# Altium schematic sheet 16 INTERFACE.SchDoc
size A2; ApprovedBy: DNP; CheckedBy: DNP; Author: DNP; CompanyName: Google LLC; DrawnBy: DNP; Organization: Google LLC; Address1: 1600 Amphitheatre Parkway; Address2: Mountain View, CA 94043; Address3: DNP; Address4: DNP; DocumentNumber: 16; SheetNumber: 16; SheetTotal: 17; VersionControl_RevNumber: DNP; IsUserConfigurable: DNP; Time: DNP; ImagePath: DNP; Rule: DNP; ProjectName: Enterprise; Application_BuildNumber: DNP
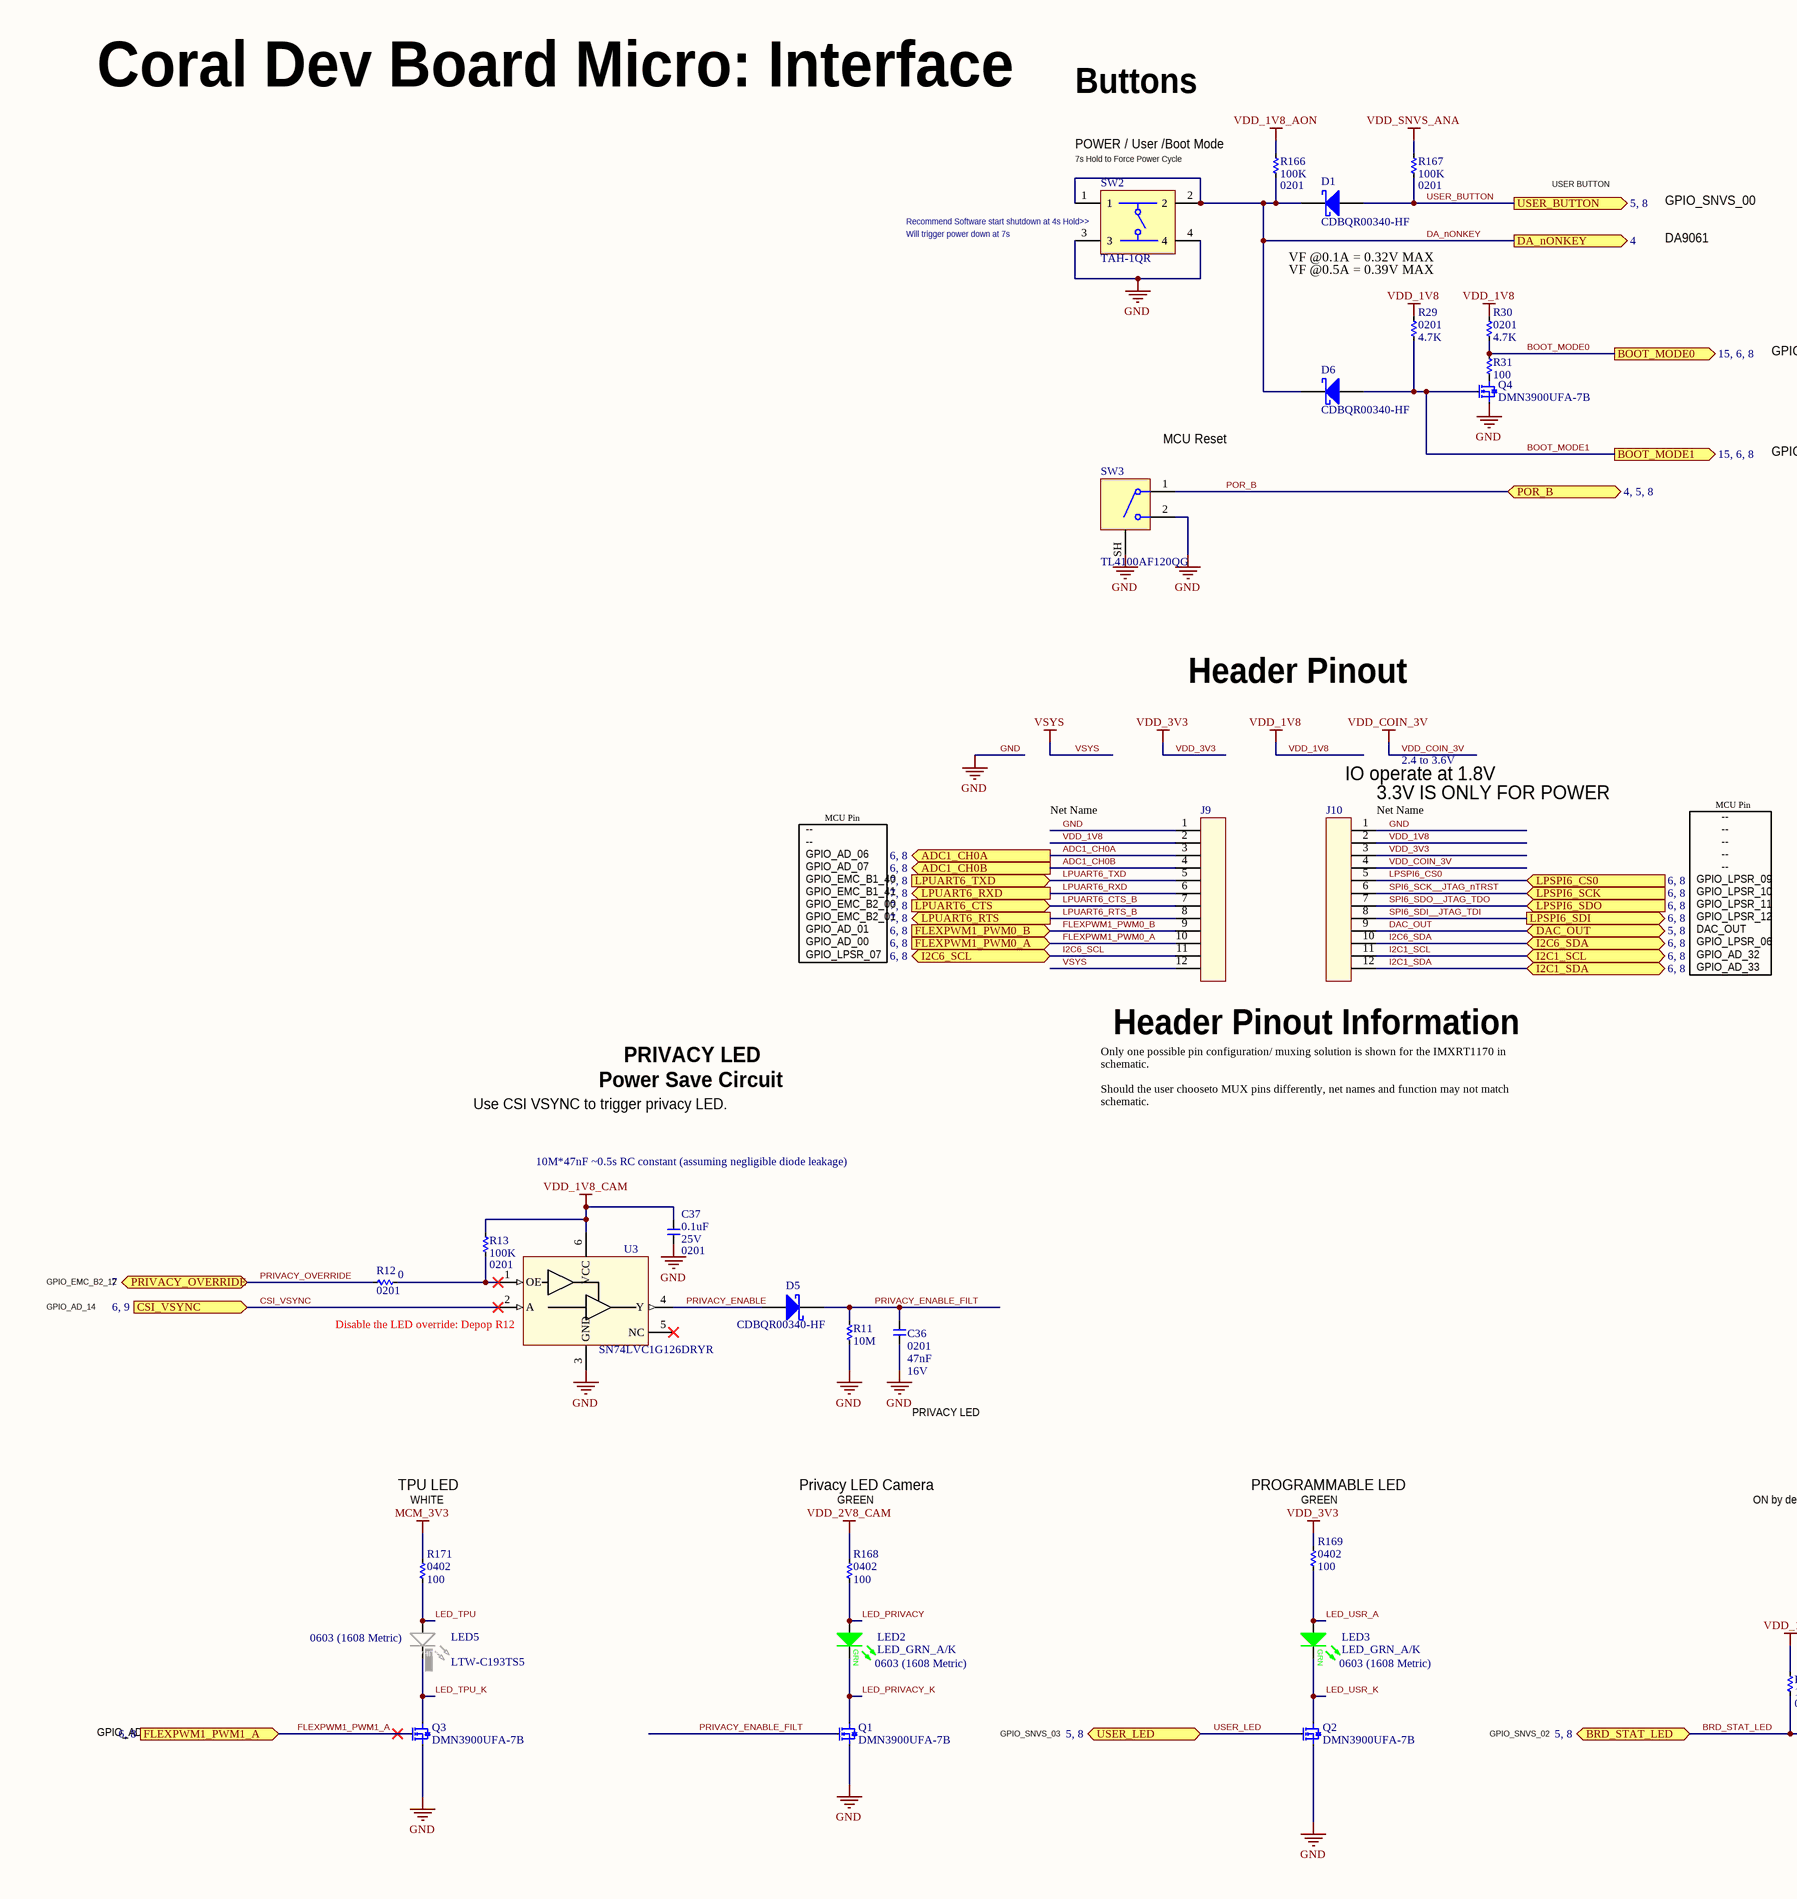
[diagram p0: 16 INTERFACE.SchDoc, left]
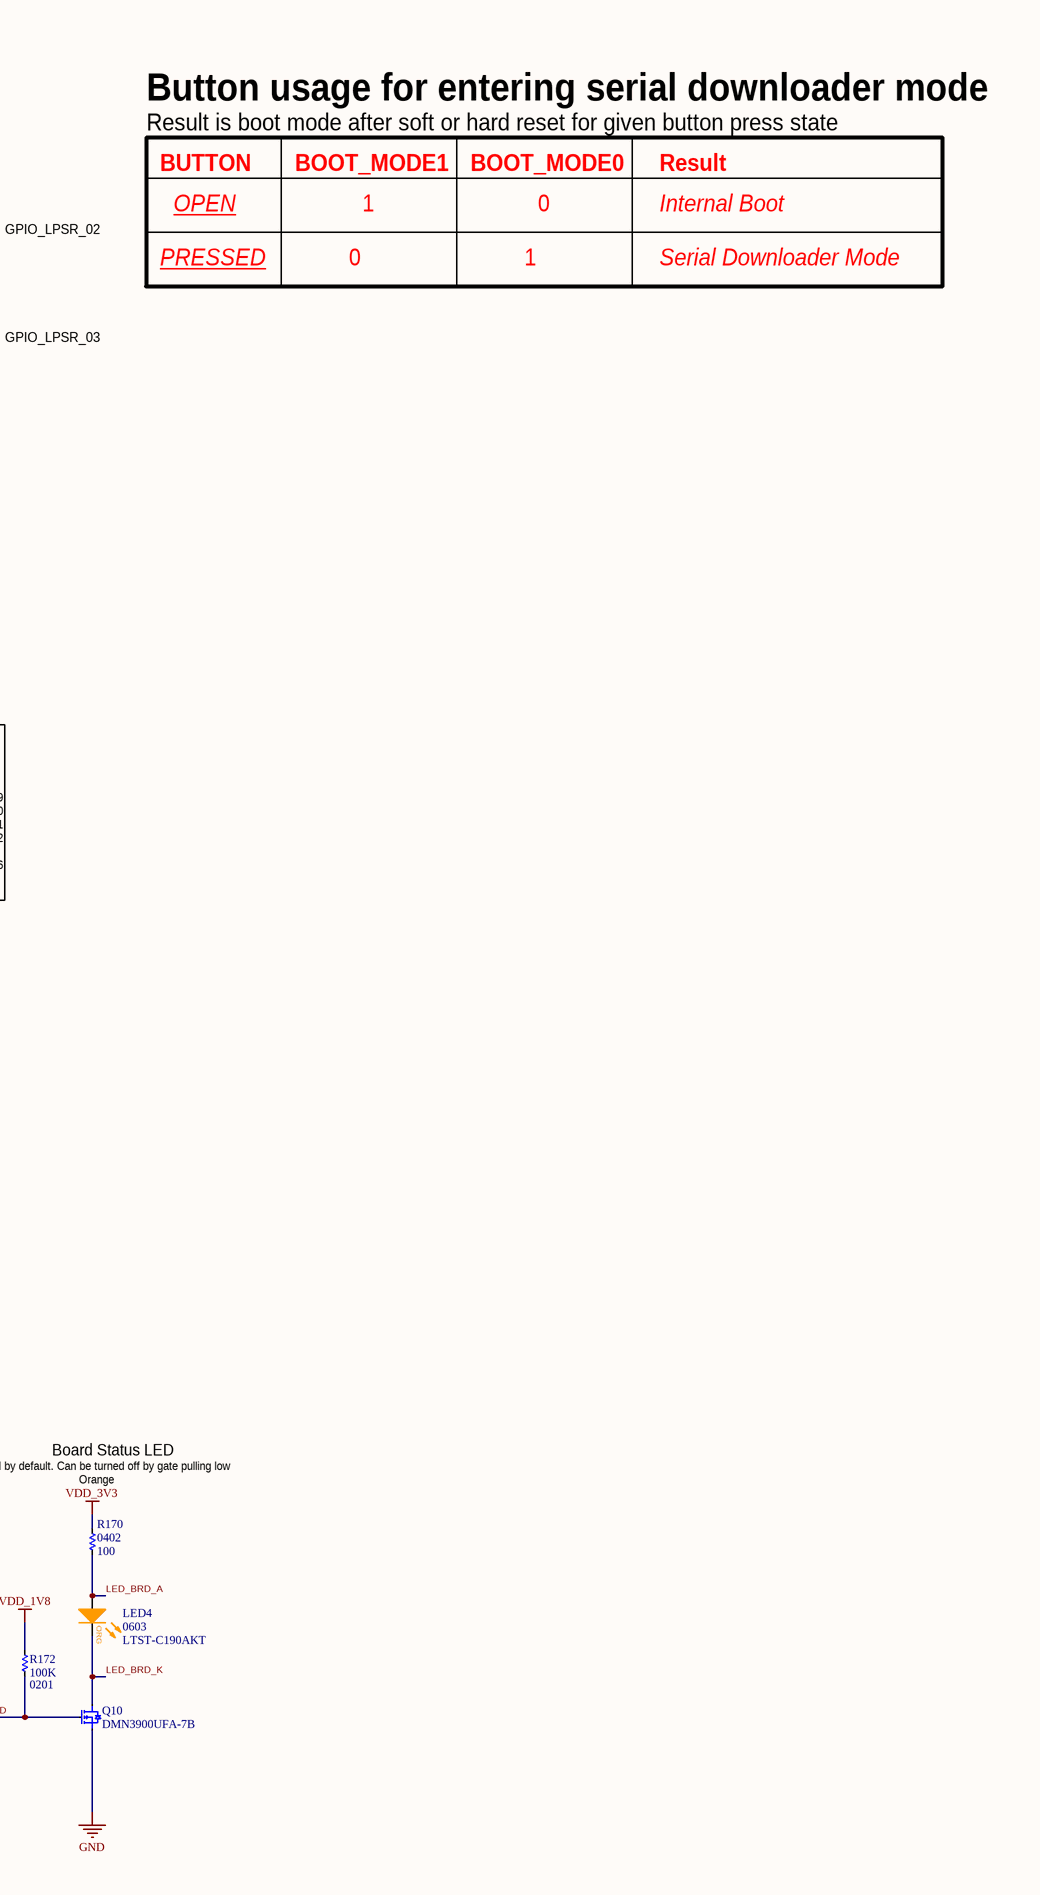
[diagram p1: 16 INTERFACE.SchDoc, right]

## Parts
C36  value 47nF  Package: 0201  Voltage: 16V  [C0201]  (hidden comment: __Template_Cap)
C37  value 0.1uF  Package: 0201  Voltage: 25V  [C0201Y]  (hidden comment: __Template_Cap)
D1  value CDBQR00340-HF  [D0402_H0.55MM]  (hidden comment: __Template_DIODE_SCHOTTKY)
D5  value CDBQR00340-HF  [D0402_H0.55MM]  (hidden comment: __Template_DIODE_SCHOTTKY)
D6  value CDBQR00340-HF  [D0402_H0.55MM]  (hidden comment: __Template_DIODE_SCHOTTKY)
J9  (no value)  [HEADER_1X12_POS_UNSHROUDED]
J10  (no value)  [HEADER_1X12_POS_UNSHROUDED]
LED2  LED_GRN_A/K  Package: 0603 (1608 Metric)  [LED_0603_0.67mm]
LED3  LED_GRN_A/K  Package: 0603 (1608 Metric)  [LED_0603_0.67mm]
LED4  value LTST-C190AKT  Package: 0603  [LED_0603P_ORANGE]  (hidden comment: __Template_LED_ORG)
LED5  value LTW-C193TS5  Package: 0603 (1608 Metric)  [LED_0603P_WHITE]  (hidden comment: __Template_LED_WHT)
Q1  MFG P/N: DMN3900UFA-7B  [3XDFN]  (hidden comment: NFET_DMN3900UFA)
Q2  MFG P/N: DMN3900UFA-7B  [3XDFN]  (hidden comment: NFET_DMN3900UFA)
Q3  MFG P/N: DMN3900UFA-7B  [3XDFN]  (hidden comment: NFET_DMN3900UFA)
Q4  MFG P/N: DMN3900UFA-7B  [3XDFN]  (hidden comment: NFET_DMN3900UFA)
Q10  MFG P/N: DMN3900UFA-7B  [3XDFN]  (hidden comment: NFET_DMN3900UFA)
R11  value 10M  [R0402]
R12  value 0  Package: 0201  [R0201]
R13  value 100K  Package: 0201  [R0201]
R29  value 4.7K  Package: 0201  [R0201]
R30  value 4.7K  Package: 0201  [R0201]
R31  value 100  [R0201]
R166  value 100K  Package: 0201  [R0201]
R167  value 100K  Package: 0201  [R0201]
R168  value 100  Package: 0402  [R0402]
R169  value 100  Package: 0402  [R0402]
R170  value 100  Package: 0402  [R0402]
R171  value 100  Package: 0402  [R0402]
R172  value 100K  Package: 0201  [R0201]
SW2  MFG P/N: TAH-1QR  [SWITCH_TAH1QR]  (hidden comment: SWITCH_TAH1QR)
SW3  MFG P/N: TL4100AF120QG  [SWITCH_TL4100AF120QG]  (hidden comment: SWITCH_E-SWITCH_TL4100AF120QG)
U3  MFG P/N: SN74LVC1G126DRYR  [SON50P145X100X60-6]  (hidden comment: BUF_SN74LVC1G126DRYR)

## Ports
ADC1_CH0A (out, see 6, 8), ADC1_CH0B (out, see 6, 8), BOOT_MODE0 (out, see 15, 6, 8), BOOT_MODE1 (out, see 15, 6, 8), BRD_STAT_LED (bidir, see 5, 8), CSI_VSYNC (in, see 6, 9), DA_nONKEY (out, see 4), DAC_OUT (bidir, see 5, 8), FLEXPWM1_PWM0_A (in, see 6, 8), FLEXPWM1_PWM0_B (in, see 6, 8), FLEXPWM1_PWM1_A (in, see 6, 8), I2C1_SCL (bidir, see 6, 8), I2C1_SDA (bidir, see 6, 8), I2C6_SCL (bidir, see 6, 8), I2C6_SDA (bidir, see 6, 8), LPSPI6_CS0 (in, see 6, 8), LPSPI6_SCK (in, see 6, 8), LPSPI6_SDI (out, see 6, 8), LPSPI6_SDO (in, see 6, 8), LPUART6_CTS (in, see 7, 8), LPUART6_RTS (out, see 7, 8), LPUART6_RXD (out, see 7, 8), LPUART6_TXD (in, see 7, 8), POR_B (bidir, see 4, 5, 8), PRIVACY_OVERRIDE (bidir, see 7), USER_BUTTON (out, see 5, 8), USER_LED (bidir, see 5, 8)

## Nets
GND: C36.2 C37.2 J9.1 J10.1 Q1.2(S) Q2.2(S) Q3.2(S) Q4.2(S) Q10.2(S) R11.1 SW2.3 SW2.4 SW3.2 SW3.SH U3.3(GND)
MCM_3V3: R171.2
VDD_1V8: J9.2 J10.2 R29.2 R30.2 R172.2
VDD_1V8_AON: R166.2
VDD_1V8_CAM: C37.1 R13.2 U3.6(VCC)
VDD_2V8_CAM: R168.2
VDD_3V3: J10.3 R169.2 R170.2
VDD_COIN_3V: J10.4
VDD_SNVS_ANA: R167.2
VSYS: J9.12
ADC1_CH0A: J9.3 ; port ADC1_CH0A
ADC1_CH0B: J9.4 ; port ADC1_CH0B
BOOT_MODE0: R30.1 R31.2 ; port BOOT_MODE0
BOOT_MODE1: D6.A Q4.1(G) R29.1 ; port BOOT_MODE1
BRD_STAT_LED: Q10.1(G) R172.1 ; port BRD_STAT_LED
CSI_VSYNC: U3.2(A) ; port CSI_VSYNC
DA_nONKEY: D1.K D6.K R166.1 SW2.1 SW2.2 ; port DA_nONKEY
DAC_OUT: J10.9 ; port DAC_OUT
FLEXPWM1_PWM0_A: J9.10 ; port FLEXPWM1_PWM0_A
FLEXPWM1_PWM0_B: J9.9 ; port FLEXPWM1_PWM0_B
FLEXPWM1_PWM1_A: Q3.1(G) ; port FLEXPWM1_PWM1_A
I2C1_SCL: J10.11 ; port I2C1_SCL
I2C1_SDA: J10.12 ; port I2C1_SDA
I2C6_SCL: J9.11 ; port I2C6_SCL
I2C6_SDA: J10.10 ; port I2C6_SDA
LED_BRD_A: LED4.2(A) R170.1
LED_BRD_K: LED4.1(K) Q10.3(D)
LED_PRIVACY: LED2.A R168.1
LED_PRIVACY_K: LED2.K Q1.3(D)
LED_TPU: LED5.2(A) R171.1
LED_TPU_K: LED5.1(K) Q3.3(D)
LED_USR_A: LED3.A R169.1
LED_USR_K: LED3.K Q2.3(D)
LPSPI6_CS0: J10.5 ; port LPSPI6_CS0
LPUART6_CTS_B: J9.7 ; port LPUART6_CTS
LPUART6_RTS_B: J9.8 ; port LPUART6_RTS
LPUART6_RXD: J9.6 ; port LPUART6_RXD
LPUART6_TXD: J9.5 ; port LPUART6_TXD
POR_B: SW3.1 ; port POR_B
PRIVACY_ENABLE: D5.A U3.4(Y)
PRIVACY_ENABLE_FILT: C36.1 D5.K Q1.1(G) R11.2
PRIVACY_OVERRIDE: R12.2 ; port PRIVACY_OVERRIDE
SPI6_SCK__JTAG_nTRST: J10.6 ; port LPSPI6_SCK
SPI6_SDI__JTAG_TDI: J10.8 ; port LPSPI6_SDI
SPI6_SDO__JTAG_TDO: J10.7 ; port LPSPI6_SDO
USER_BUTTON: D1.A R167.1 ; port USER_BUTTON
USER_LED: Q2.1(G) ; port USER_LED
NetQ4_3: Q4.3(D) R31.1
NetR12_1: R12.1 R13.1 U3.1(OE)

Not connected (* = marked no-connect by the designer): U3 5(NC)*

## Notes on the sheet
- Coral Dev Board Micro: Interface
- Buttons
- POWER / User /Boot Mode
- (near SW2) 7s Hold to Force Power Cycle
- (near SW2) Recommend Software start shutdown at 4s Hold>>
- Will trigger power down at 7s
- USER BUTTON
- GPIO_SNVS_00
- Button usage for entering serial downloader mode
- VF @0.1A = 0.32V MAX
- VF @0.5A = 0.39V MAX
- DA9061
- Result is boot mode after soft or hard reset for given button press state
- BUTTON
- BOOT_MODE1
- BOOT_MODE0
- Result
- GPIO_LPSR_02
- OPEN
- 1
- 0
- Internal Boot
- PRESSED
- Serial Downloader Mode
- (near SW3) MCU Reset
- GPIO_LPSR_03
- Header Pinout
- IO operate at 1.8V
- 3.3V IS ONLY FOR POWER
- 2.4 to 3.6V
- MCU Pin
- GPIO_AD_06
- --
- Net Name
- (near J10) Net Name
- GPIO_EMC_B1_40
- GPIO_EMC_B1_41
- GPIO_EMC_B2_00
- GPIO_EMC_B2_01
- GPIO_AD_01
- GPIO_AD_07
- GPIO_LPSR_09
- GPIO_LPSR_10
- GPIO_LPSR_11
- GPIO_LPSR_12
- DAC_OUT
- GPIO_AD_00
- GPIO_LPSR_07
- GPIO_AD_32
- GPIO_AD_33
- GPIO_LPSR_06
- Header Pinout Information
- Power Save Circuit
- PRIVACY LED
- Only one possible pin configuration/ muxing solution is shown for the IMXRT1170 in schematic.
  Should the user chooseto MUX pins differently, net names and function may not match schematic.
- Use CSI VSYNC to trigger privacy LED.
  Discharge RC time constant approximately 500ms. Likely to be shorter due to leakage paths.
- 10M*47nF ~0.5s RC constant (assuming negligible diode leakage)
- GPIO_EMC_B2_12
- GPIO_AD_14
- (near U3) Disable the LED override: Depop R12
- TPU LED
- Privacy LED Camera
- PROGRAMMABLE LED
- Board Status LED
- WHITE
- GREEN
- (near R169) GREEN
- ON by default. Can be turned off by gate pulling low
- (near R170) Orange
- GPIO_AD_02
- GPIO_SNVS_03
- GPIO_SNVS_02
- Project:
- Engineer:
- Date:
- File:
- Revision:
- Sheet
- of
- (in symbol 61) ORG
- (in symbol 197) GRN

## Library data of the parts
C36 = 799: CAP, CER, X6S, 0.047uF, 16V, 10%, 0201, 0.33mm T; ID: 799; MFG: TDK; MFG P/N: C0603X6S1C473K030BC; XPN: 150-00153-00; Status: NRND; Dielectric: X6S; Tolerance: 10%; Height: 0.33mm T; ComponentLink1Description: Datasheet; COMMON: 150-00153-00
C37 = 386: CAP, CER, X5R, 0.1uF, 25V, 20%, 0201, 0.33mm T; ID: 386; MFG: MURATA; MFG P/N: GRM033R61E104ME14D; XPN: 150-01204-00; Status: Released; Dielectric: X5R; Tolerance: 20%; Height: 0.33mm T; ComponentLink1Description: Datasheet; COMMON: 150-01204-00; LOON: 150-01204-00; Gecko: 150-01204-00
D1 D5 D6 = 353: DIODE, SCHOTTKY, 40V VRRM, 30mA IO, 500mA SURGE, 0402; ID: 353; MFG: Comchip Technology; Voltage – Forward (VF) (MAX) @ IF: 370 mV @ 1 mA; Current - Reverse Leakage @ VR: 1 µA @ 40 V; Status: Released; MFG P/N: CDBQR00340-HF; Package: 0402; Category: DIODE; RoHS Compliant: Yes; Diode Type: Schottky; Mounting Type: SMD; Voltage - DC Reverse (VR) (MAX): 40V; Current - Average Rectified (IO): 30mA; Operating Temperature – Junction: 125°C (Max); Supplier 1: Digi-Key; HelpURL: https://www.digikey.com/en/products/detail/comchip-technology/CDBQR00340-HF/3308478?s=N4IgTCBcDaIMIBEBCBFASgBgwZgCwYFoAJAMRAF0BfIA; ComponentLink1Description: Datasheet; ComponentLink1URL: https://www.comchiptech.com/admin/files/product/QW-G1106%20CDBQR00340-HF%20RevB.pdf; Height: 0.55mm; Supplier Part Number 1: 641-1978-2-ND
J9 J10 = 366: CONN, HDR, TH, STR, 1X12, 2.54mmP; ID: 366; MFG: SULLINS; MFG P/N: PBC12SAAN; COMMON: 210-00118-00; Status: Released; RoHS Compliant: Yes; LOON: 210-00118-00; XPN: 210-00118-00; Gecko: 210-00118-00
LED2 LED3 = 197: LED, GREEN, 570nm, 25mA, DIFFUSED, 0603; ID: 197; MFG: OSRAM Opto Semiconductors Inc.; MFG P/N: LG L29K-G2J1-24-Z; Value: LG L29K-G2J1-24-Z; Voltage – Forward (VF) (MAX) @ IF: 1.7V; COMMON: 370-00021-00; PROXY: 370-00433-00; Status: In Development; Category: LED; RoHS Compliant: Yes; Diode Type: LED; Mounting Type: SMD; Supplier 1: Digi-Key; HelpURL: https://www.digikey.in/product-detail/en/osram-opto-semiconductors-inc/LG-L29K-G2J1-24-Z/475-2709-1-ND/1938876; ComponentLink1Description: Datasheet; ComponentLink1URL: https://dammedia.osram.info/media/resource/hires/osram-dam-2493945/LG%20L29K.pdf; LOON: 370-00021-00; Color / Wavelength: GREEN; Supplier Part Number 1: 475-2709-1-ND
LED4 = 61: LED, ORANGE, 610NM, WATER CLEAR, GAP, 0603; ID: 61; MFG: Lite-On Technology Corp; Current - Average Rectified (IO): 10mA; Voltage – Forward (VF) (MAX) @ IF: 2.1V; PROXY: 246-00083-00; XPN: XS-10006042; Gecko: 370-00585-00; Orbital: 370-00646-00; Status: Released; MFG P/N: LTST-C190AKT; Category: Diode; Diode Type: LED; Mounting Type: SM; Operating Temperature – Junction: -40°C ~ 85°C; Supplier 1: Digi-Key; HelpURL: http://media.digikey.com/pdf/Data%20Sheets/Lite-On%20PDFs/LTST-C190AKT.pdf; ComponentLink1Description: Datasheet; ComponentLink1URL: http://media.digikey.com/pdf/Data%20Sheets/Lite-On%20PDFs/LTST-C190AKT.pdf; Color / Wavelength: ORANGE; Supplier Part Number 1: 160-1180-1-ND
LED5 = 69: LED, WHITE, 0603, SMD; ID: 69; MFG: Lite-On Technology Corp; Current - Average Rectified (IO): 5mA; Voltage – Forward (VF) (MAX) @ IF: 2.93V; COMMON: 246-00092-00; KOI: 370-00551-00; XPN: XS-10006051; Status: Released; MFG P/N: LTW-C193TS5; Category: Diode; Diode Type: LED; Mounting Type: SM; Operating Temperature – Junction: -20°C ~ +80°C; Supplier 1: Digi-Key; HelpURL: http://optoelectronics.liteon.com/upload/download/DS22-2004-203/S_110_LTW-C193TS5.pdf; ComponentLink1Description: Datasheet; ComponentLink1URL: http://optoelectronics.liteon.com/upload/download/DS22-2004-203/S_110_LTW-C193TS5.pdf; LOON: 246-00092-00; Gecko: 246-00092-00; Color / Wavelength: WHITE; Supplier Part Number 1: 160-1721-1-ND
Q1-Q4 Q10 = 24: MOSFET, N-CH, 30V, 0.55A, DMN3900; ID: 24; MFG: Diodes Incorporated; FET Type: MOSFET N-Channel, Metal Oxide; FET Feature: Logic Level Gate; Current - Continuios Drain (ID) @ 25° C: 550mA; RDS On (Max) @ ID, VGS: 760 mOhm @ 200mA, 4.5V; VGS(TH) (Max) @ ID: 950mV @ 250µA; Gate Charge (QG) @ VGS: 0.7nC @ 4.5V; Input Capacitance (CISS) @ VDS: 42.2pF @ 25V; Power - Max: 390mW; COMMON: 480-00750-00; XPN: XS-10020699; EES: 480-01751-00; Status: Released; Package: 3-XFDFN; Category: Discrete Semiconductor Products; RoHS Compliant: Yes; HelpURL: http://www.diodes.com/datasheets/DMN3900UFA.pdf; ComponentLink1Description: Datasheet; ComponentLink1URL: http://www.diodes.com/datasheets/DMN3900UFA.pdf; Voltage - Drain To Source (VDSS): 30V; Mounting Type: SM; Supplier 1: Digi-Key; Supplier Part Number 1: DMN3900UFA-7BCT-ND
R11 = 6216: Resistor, 10.0M Ohms, 0402, 0.063W, ±1%; ID: 6216; MFG: YAGEO; MFG P/N: RC0402FR-0710ML; Power: 1/16W; COMMON: 470-09411-00; XPN: XS-10019877; Status: Released; Package: 0402; Tolerance: 1%; Height: 0.40mm; Supplier 1: Digi-Key; Supplier Part Number 1: 311-10.0MLRCT-ND
R12 = 8315: RES, 0.0, 1/20W, 0201; ID: 8315; MFG: PANASONIC; MFG P/N: ERJ1GN0R00C; Tolerance: JUMPER; COMMON: 470-00013-00; PROXY: Use ID #6940; Status: Released; Power: 1/20W; LOON: 470-00013-00; Gecko: 470-00013-00; XPN: 470-00013-00
R13 R166 R167 R172 = 7818: RES, 100K, 1%, 1/20W, 0201; ID: 7818; MFG: PANASONIC; MFG P/N: ERJ1GEF1003C; COMMON: 470-00506-00; Status: NRND; Power: 1/20W; Tolerance: 1%; LOON: 470-00506-00; Gecko: 470-00506-00; XPN: 470-00506-00
R29 R30 = 6602: RES, 4.7K, 5%, 1/20W, 0201; ID: 6602; MFG: YAGEO; MFG P/N: RC0201JR-074K7L; COMMON: 470-00012-00; Status: Released; Power: 1/20W; Tolerance: 5%; LOON: 470-00012-00; Gecko: 470-00012-00; XPN: 470-00012-00
R31 = 6785: RES, 100, 5%, 1/20W, 0201; ID: 6785; MFG: YAGEO; MFG P/N: RC0201JR-07100RL; COMMON: 470-00473-00; Status: Released; Package: 0201; Power: 1/20W; Tolerance: 5%; XPN: 470-00473-00
R168-R171 = 6318: RES, 100, 5%, 1/16W, 0402, AUTO GRADE; ID: 6318; MFG: VISHAY; MFG P/N: CRCW0402100RJNED; COMMON: 470-02903-00; Status: Released; Power: 1/16W; Tolerance: 5%; XPN: 470-02903-00
SW2 = 205: SW, TACT, SPST, 0.05A, 16VDC, OVAL ACTUATOR, SMD; ID: 205; MFG: Diptronics; Status: Released; Category: TACTILE SWITCH; RoHS Compliant: Yes; Supplier 1: Mouser; Height: 2.7mm; Mounting Type: SMD; HelpURL: https://www.mouser.com/ProductDetail/Diptronics/TAH-1QR?qs=%2Fha2pyFaduipOSvjgYeYPSjN0bL8fZLbb5mXZs85d5Y%3D; ComponentLink1Description: Datasheet; ComponentLink1URL: https://drive.google.com/file/d/13CKM1hC869BRhfaIa7pbNI_rAmBVZshp/view; Supplier Part Number 1: 113-TAH-1QR; Operating Temperature: -30°C ~ 85°C; Voltage, Rated: 16 VDC
SW3 = 224: SW, TACT, SPST-NO, OFF-MOM, 0.05A, 12VDC, RA, EDGE MOUNT; ID: 224; Status: Released; MFG: E-Switch; Category: Tactile Switches; RoHS Compliant: Yes; Supplier 1: Digi-Key; Height: 1.35mm; Mounting Type: SMD; HelpURL: https://www.digikey.com/en/products/detail/e-switch/TL4100AF120QG/2685028?s=N4IgTCBcDaICoBkAsBGADGgggMRWNAigOIgC6AvkA; ComponentLink1Description: Datasheet; ComponentLink1URL: http://spec_sheets.e-switch.com/specs/P004000.pdf; Supplier Part Number 1: EG4963TR-ND; Operating Temperature: -40°C ~ 85°C
U3 = 438: IC, BUFFER, 74LVC1G126, NON-INVERT, SINGLE ELEMENT, 3-STATE O/P, 32mA, 1.65V TO 5.5V VIN, UFDFN-6; ID: 438; MFG: Texas Instruments; Status: Released; Package: 6-SON (1.45x1); Category: Integrated Circuits (ICs); RoHS Compliant: Yes; Supplier 1: Digi-Key; ComponentLink1Description: Datasheet; ComponentLink1URL: https://www.ti.com/lit/ds/symlink/sn74lvc1g126.pdf?HQS=dis-dk-null-digikeymode-dsf-pf-null-wwe&ts=1622160361458; Mounting Type: SMD; Height: 0.6mm; Supplier Part Number 1: 296-SN74LVC1G126DRYRTR-ND; HelpURL: https://www.digikey.com/en/products/detail/texas-instruments/SN74LVC1G126DRYR/1591998?s=N4IgTCBcDaIMoDkDsAWAMgNQMIEYDiOYAbACIBKAmmSALoC%2BQA